# Altium schematic sheet 02_BLOCK-DIAGRAM.SchDoc
size A4; CheckedBy: Inženjer 2; CompanyName: Byte Lab Grupa d.o.o.; Engineer: Matija Puskar; Organization: Byte Lab Grupa d.o.o.; Address1: Medarska 69/1, 10000 Zagreb, Croatia; DocumentNumber: 1; SheetNumber: 2; SheetTotal: 7; Web: www.byte-lab.com; ProjectName: P1X-0XX
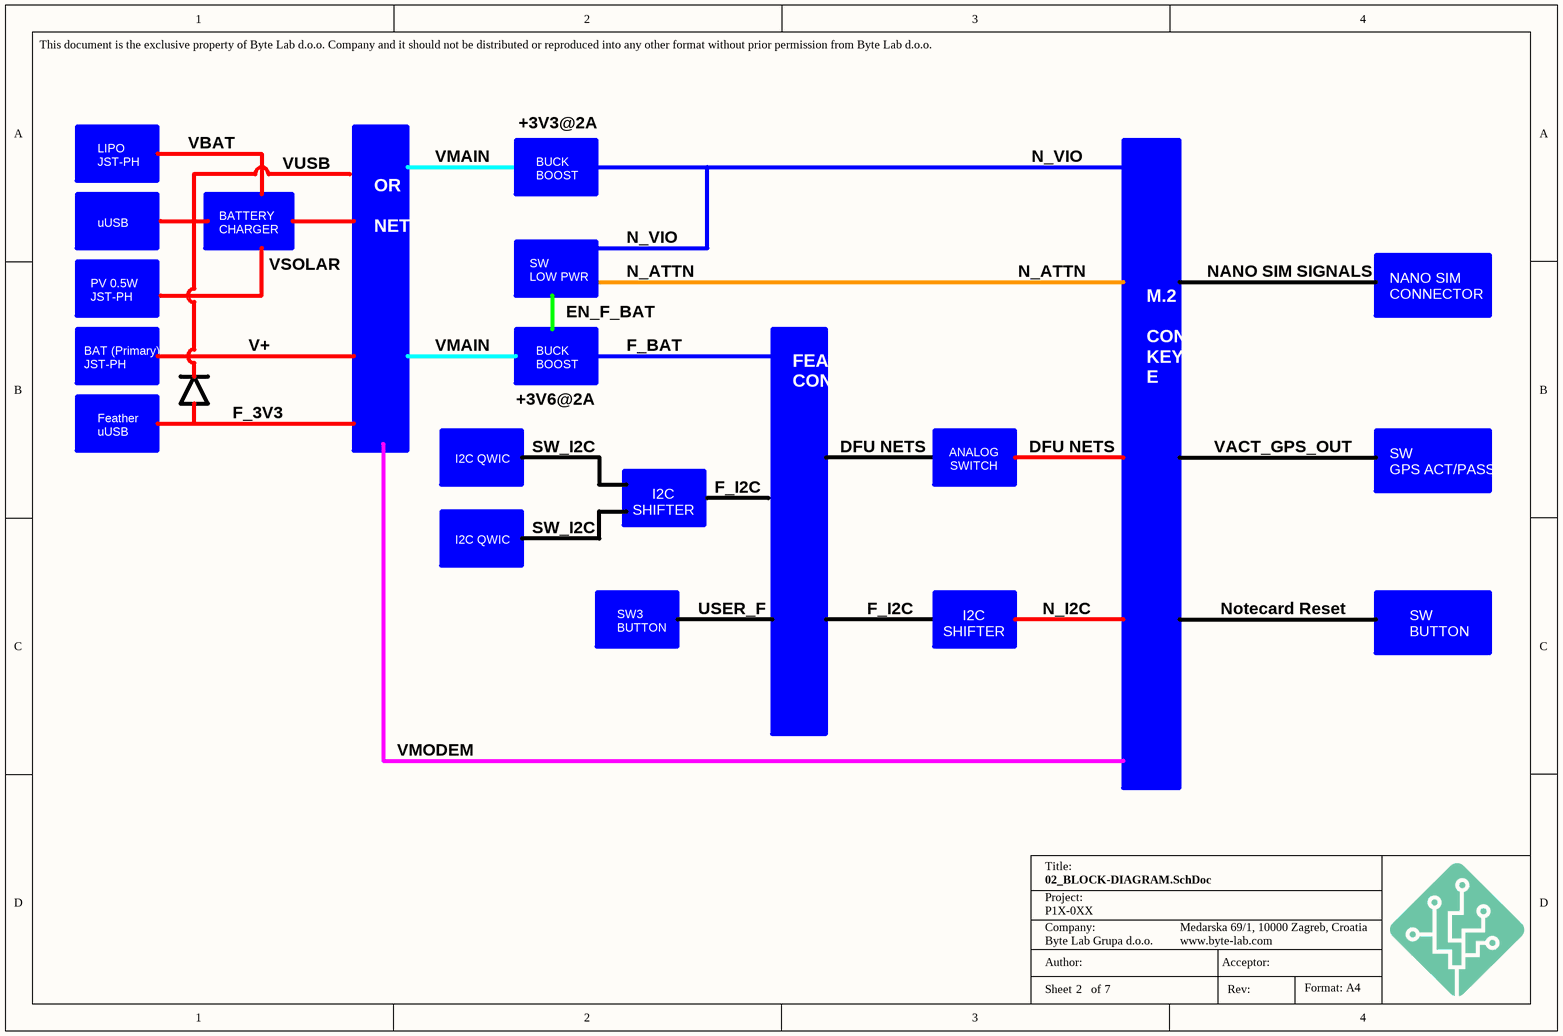
[diagram p0: 02_BLOCK-DIAGRAM.SchDoc]

## Notes on the sheet
- VBAT
- VUSB
- VMAIN
- +3V3@2A
- N_VIO
- uUSB
- LIPO
  JST-PH
- BUCK
  BOOST
- PV 0.5W
  JST-PH
- BATTERY
  CHARGER
- VSOLAR
- SW
  LOW PWR
- N_ATTN
- NANO SIM SIGNALS
- V+
- EN_F_BAT
- F_BAT
- NANO SIM
  CONNECTOR
- BAT (Primary)
  JST-PH
- F_3V3
- OR
  NETWORKT
- +3V6@2A
- Feather
  uUSB
- I2C QWIC
- SW_I2C
- F_I2C
- DFU NETS
- ANALOG
  SWITCH
- VACT_GPS_OUT
- SW
  GPS ACT/PASS
- I2C
  SHIFTER
- SW3 BUTTON
- USER_F
- N_I2C
- Notecard Reset
- SW
  BUTTON
- FEATHER   CONNECTOR
- M.2
  CONNECTOR KEY E
- VMODEM
- This document is the exclusive property of Byte Lab d.o.o. Company and it should not be distributed or reproduced into any other format without prior permission from Byte Lab d.o.o.
- Project:
- Title:
- Author:
- Company:
- Acceptor:
- Format: A4
- Sheet
- of
- Rev: